# Altium schematic sheet Affichage.SchDoc
size A
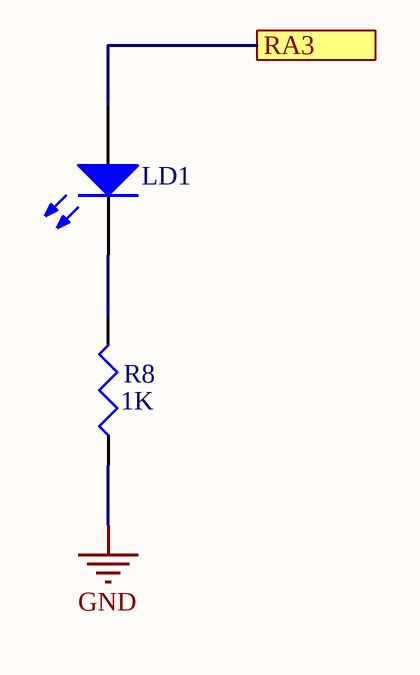
[diagram p0: Affichage.SchDoc]

## Parts
LD1  LED2  [3.2X1.6X1.1]  (value not drawn)
R8  value 1K  [J1-0603]  (hidden comment: Res3)

## Ports
RA3

## Nets
GND: R8.1
RA3: LD1.1(A) ; port RA3
NetLD1_2: LD1.2(K) R8.2

## Library data of the parts
LD1 = LED2: Typical RED, GREEN, YELLOW, AMBER GaAs LED; Published: 8-Jun-2000; LatestRevisionDate: 17-Jul-2002; LatestRevisionNote: Re-released for DXP Platform.; PackageVersion: Feb-2002; PackageReference: 3.2X1.6X1.1; Publisher: Altium Limited; PackageDescription: SM LED; 2 Flat Leads
R8 = Res3: Resistor; Published: 8-Jun-2000; LatestRevisionDate: 29-May-2009; LatestRevisionNote: IPC-7351 Footprint Added.; PackageReference: J1-0603; Publisher: Altium Limited; PackageDescription: Chip Resistor